# Altium schematic sheet Sheet1.SchDoc
size 420 x 297 mm; SheetNumber: 1; SheetTotal: 1
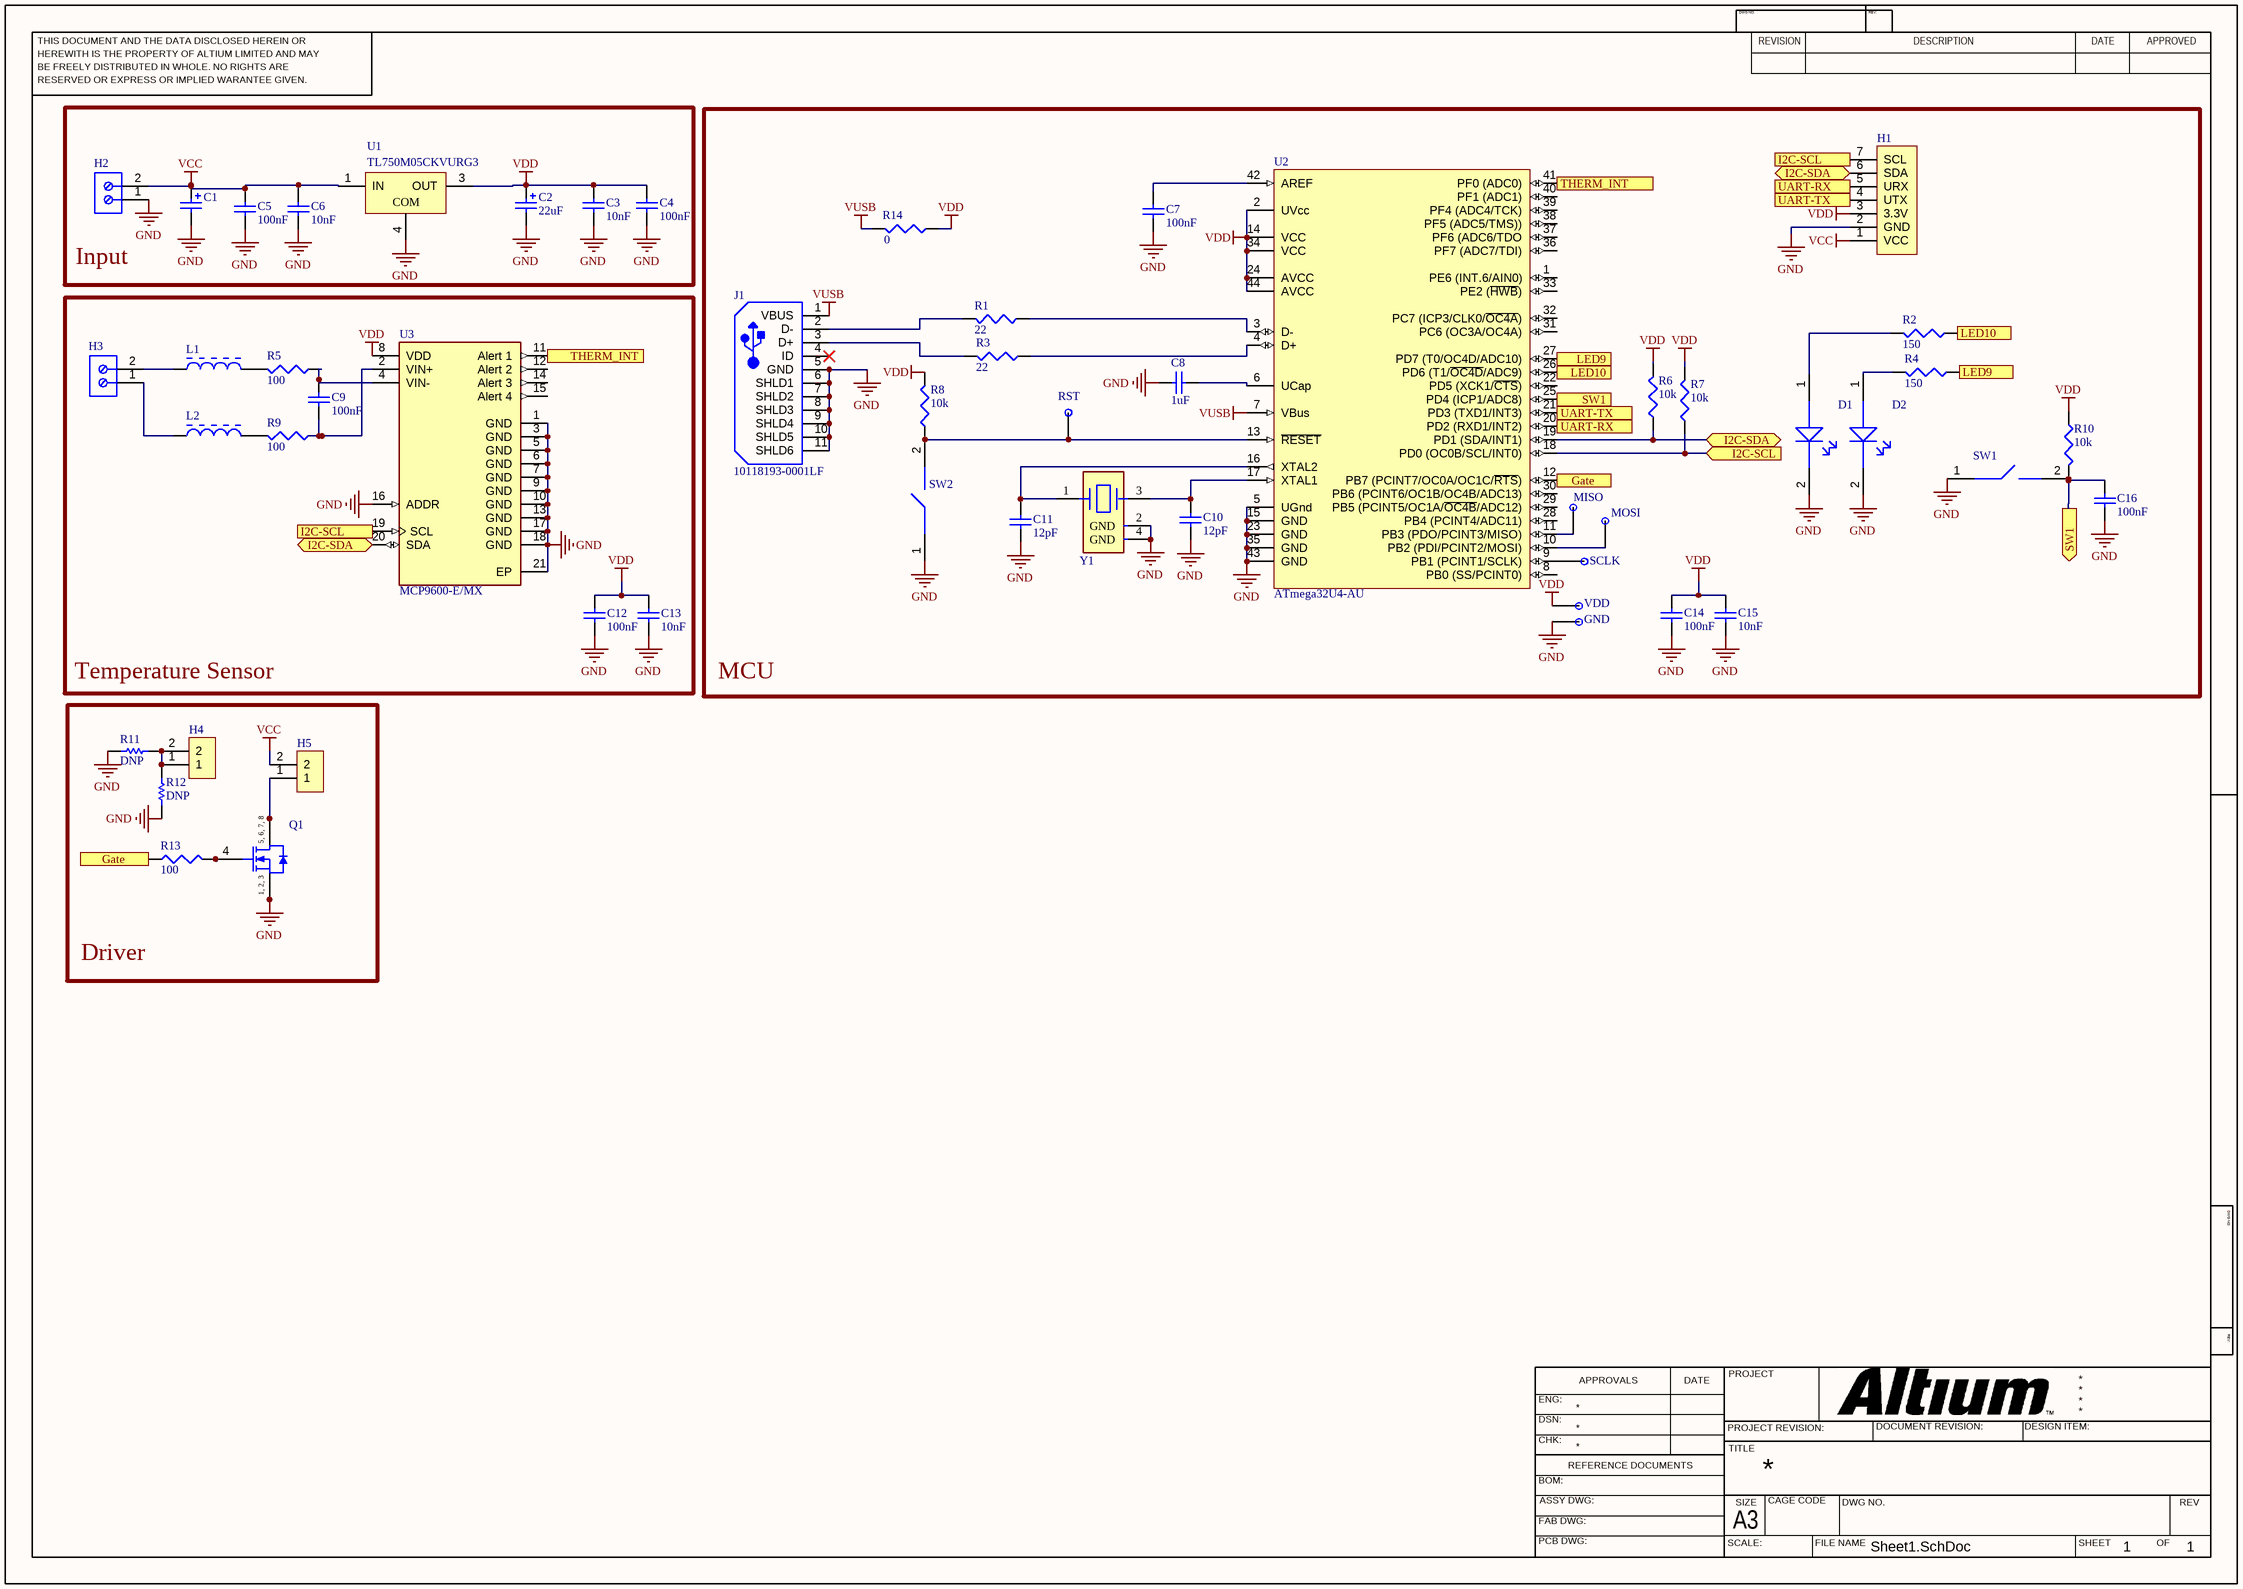
[diagram p0: Sheet1.SchDoc]

## Parts
C1  UBC1H470MNS1GS  [UBC1H470MNS1GS]  (value not drawn)
C2  22uF  [CAPAE4343X55M]
C3  10nF  [RESC1608X04N]
C4  100nF  [RESC1608X04N]
C5  100nF  [RESC1608X04N]
C6  10nF  [RESC1608X04N]
C7  100nF  [RESC1608X04N]
C8  1uF  [RESC1608X04N]
C9  100nF  [RESC1608X04N]
C10  12pF  [RESC1608X04N]
C11  12pF  [RESC1608X04N]
C12  100nF  [RESC1608X04N]
C13  10nF  [RESC1608X04N]
C14  100nF  [RESC1608X04N]
C15  10nF  [RESC1608X04N]
C16  100nF  [RESC1608X04N]
D1  'LTST-C190KFKT  [RESC1608X04N]  (value not drawn)
D2  'LTST-C190KFKT  [RESC1608X04N]  (value not drawn)
GND  TESTPAD  [TESTPAD]  (value not drawn)
H1  castellated holes  [castellated holes]  (value not drawn)
H2  691508110302  [691508110302]  (value not drawn)
H3  691508110302  [691508110302]  (value not drawn)
H4  MOTHER PADS  [MOTHER PADS]  (value not drawn)
H5  MOTHER PADS  [MOTHER PADS]  (value not drawn)
J1  10118193-0001LF  [FCI-10118193-0001LF-5_V]
L1  LI0805H151R-10  [LIRD-LI0805H151R-10-2_V]  (value not drawn)
L2  LI0805H151R-10  [LIRD-LI0805H151R-10-2_V]  (value not drawn)
MISO  TESTPAD  [TESTPAD]  (value not drawn)
MOSI  TESTPAD  [TESTPAD]  (value not drawn)
Q1  BSC0906NS  [INF-PG-TDSON-8-1_V]  (value not drawn)
R1  22  [RESC1608X04N]
R2  150  [RESC1608X04N]
R3  22  [RESC1608X04N]
R4  150  [RESC1608X04N]
R5  100  [RESC1608X04N]
R6  10k  [RESC1608X04N]
R7  10k  [RESC1608X04N]
R8  10k  [RESC1608X04N]
R9  100  [RESC1608X04N]
R10  10k  [RESC1608X04N]
R11  DNP  [RESC1005X40X25ML5T10]
R12  DNP  [RESC1005X40X25ML5T10]
R13  100  [RESC1608X04N]
R14  0  [RESC1608X04N]
RST  TESTPAD  [TESTPAD]  (value not drawn)
SCLK  TESTPAD  [TESTPAD]  (value not drawn)
SW1  PTS815 SJK 250 SMTR LFS  [PTS815 SJK 250 SMTR LFS]  (value not drawn)
SW2  PTS815 SJK 250 SMTR LFS  [PTS815 SJK 250 SMTR LFS]  (value not drawn)
U1  TL750M05CKVURG3  [KVU0003A_M]
U2  ATmega32U4-AU  [44ML_M]
U3  MCP9600-E/MX  [FP-C04-186-MFG]
VDD  TESTPAD  [TESTPAD]  (value not drawn)
Y1  TSX-3225 16.0000MF09Z-AC0  [FP-TSX-3225-MFG]  (value not drawn)

## Blocks framed on the sheet
Input: C1-C6 H2 U1
MCU: C7 C8 C10 C11 C14-C16 D1 D2 GND H1 J1 MISO MOSI R1-R4 R6-R8 R10 R14 RST SCLK SW1 SW2 U2 VDD Y1
Temperature Sensor: C9 C12 C13 H3 L1 L2 R5 R9 U3
Driver: H4 H5 Q1 R11-R13

## Ports
Gate (in), Gate (out), I2C-SCL (in), I2C-SDA (bidir), LED9 (in), LED9 (out), LED10 (in), LED10 (out), SW1 (in), SW1 (out), THERM_INT (out), UART-RX (in), UART-TX (in)

## Nets
GND: C1.2 C2.2 C3.1 C4.1 C5.1 C6.1 C7.2 C8.1 C10.2 C11.2 C12.2 C13.2 C14.2 C15.2 C16.2 D1.2 D2.2 GND.1 H1.2(GND) H2.1 J1.5(GND) J1.6(SHLD1) J1.7(SHLD2) J1.8(SHLD3) J1.9(SHLD4) J1.10(SHLD5) J1.11(SHLD6) Q1.1(SOURCE) Q1.2(SOURCE) Q1.3(SOURCE) R11.1 R12.1 SW1.1 SW2.1 U1.4(COM) U2.5(UGnd) U2.15(GND) U2.23(GND) U2.35(GND) U2.43(GND) U3.1(GND) U3.3(GND) U3.5(GND) U3.6(GND) U3.7(GND) U3.9(GND) U3.10(GND) U3.13(GND) U3.16(ADDR) U3.17(GND) U3.18(GND) U3.21(EP) Y1.2(GND) Y1.4(GND)
VCC: C1.1 C5.2 C6.2 H1.1(VCC) H2.2 H5.2 U1.1(IN)
VDD: C2.1 C3.2 C4.2 C12.1 C13.1 C14.1 C15.1 H1.3(3.3V) R6.2 R7.2 R8.2 R10.1 R14.1 U1.3(OUT) U2.2(UVcc) U2.14(VCC) U2.24(AVCC) U2.34(VCC) U2.44(AVCC) U3.8(VDD) VDD.1
VUSB: J1.1(VBUS) R14.2 U2.7(VBus)
Gate: R13.1 U2.12(PB7_(PCINT7/OC0A/OC1C/~{RTS})) ; port Gate
I2C-SCL: H1.7(SCL) R7.1 U2.18(PD0_(OC0B/SCL/INT0)) U3.19(SCL) ; port I2C-SCL
I2C-SDA: H1.6(SDA) R6.1 U2.19(PD1_(SDA/INT1)) U3.20(SDA) ; port I2C-SDA
LED9: R4.1 U2.27(PD7_(T0/OC4D/ADC10)) ; port LED9
LED10: R2.1 U2.26(PD6_(T1/~{OC4D}/ADC9)) ; port LED10
SW1: C16.1 R10.2 SW1.2 U2.25(PD4_(ICP1/ADC8)) ; port SW1
THERM_INT: U2.41(PF0_(ADC0)) U3.11(Alert_1) ; port THERM_INT
UART-RX: H1.5(URX) U2.20(PD2_(RXD1/INT2)) ; port UART-RX
UART-TX: H1.4(UTX) U2.21(PD3_(TXD1/INT3)) ; port UART-TX
NetC7_1: C7.1 U2.42(AREF)
NetC8_2: C8.2 U2.6(UCap)
NetC9_1: C9.1 R5.1 U3.4(VIN-)
NetC9_2: C9.2 R9.1 U3.2(VIN+)
NetC10_1: C10.1 U2.17(XTAL1) Y1.3
NetC11_1: C11.1 U2.16(XTAL2) Y1.1
NetD1_1: D1.1 R2.2
NetD2_1: D2.1 R4.2
NetH3_1: H3.1 L2.1
NetH3_2: H3.2 L1.1
NetH4_1: H4.1 H4.2 R11.2 R12.2
NetH5_1: H5.1 Q1.5(DRAIN) Q1.6(DRAIN) Q1.7(DRAIN) Q1.8(DRAIN)
NetJ1_2: J1.2(D-) R1.2
NetJ1_3: J1.3(D+) R3.2
NetL1_2: L1.2 R5.2
NetL2_2: L2.2 R9.2
NetMISO_1: MISO.1 U2.11(PB3_(PDO/PCINT3/MISO))
NetMOSI_1: MOSI.1 U2.10(PB2_(PDI/PCINT2/MOSI))
NetQ1_4: Q1.4(GATE) R13.2
NetR1_1: R1.1 U2.3(D-)
NetR3_1: R3.1 U2.4(D+)
NetR8_1: R8.1 RST.1 SW2.2 U2.13(~{RESET})
NetSCLK_1: SCLK.1 U2.9(PB1_(PCINT1/SCLK))

Not connected (* = marked no-connect by the designer): J1 4(ID)*; U2 1(PE6_(INT.6/AIN0)) 8(PB0_(SS/PCINT0)) 22(PD5_(XCK1/~{CTS})) 28(PB4_(PCINT4/ADC11)) 29(PB5_(PCINT5/OC1A/~{OC4B}/ADC12)) 30(PB6_(PCINT6/OC1B/OC4B/ADC13)) 31(PC6_(OC3A/OC4A)) 32(PC7_(ICP3/CLK0/~{OC4A})) 33(PE2_(~{HWB})) 36(PF7_(ADC7/TDI)) 37(PF6_(ADC6/TDO) 38(PF5_(ADC5/TMS))) 39(PF4_(ADC4/TCK)) 40(PF1_(ADC1)); U3 12(Alert_2) 14(Alert_3) 15(Alert_4)

## Notes on the sheet
- THIS DOCUMENT AND THE DATA DISCLOSED HEREIN OR
- HEREWITH IS THE PROPERTY OF ALTIUM LIMITED AND MAY
- DWG NO:
- REVISION
- REV:
- DESCRIPTION
- DATE
- APPROVED
- BE FREELY DISTRIBUTED IN WHOLE. NO RIGHTS ARE
- RESERVED OR EXPRESS OR IMPLIED WARANTEE GIVEN.
- ENG:
- APPROVALS
- PROJECT
- DSN:
- CHK:
- REFERENCE DOCUMENTS
- PROJECT REVISION:
- TITLE
- DOCUMENT REVISION:
- DESIGN ITEM:
- BOM:
- FAB DWG:
- PCB DWG:
- ASSY DWG:
- SCALE:
- A3
- SIZE
- CAGE CODE
- FILE NAME
- DWG NO.
- SHEET
- OF
- REV
- (in symbol CMP-1090-00064-1) 5, 6, 7, 8; 1, 2, 3

## Library data of the parts
C2 = CAP*
C3-C16 = CAP
D1 D2 = LED
H2 H3 = CMP-1502-02490-1: Serie 5081 - 3.50 mm Horizontal Entry SMT with Rising Cage Clamp WR-TBL, 2 pin; Manufacturer: Wurth Elektronik; Pitch: 3.50mm; Pin Number: 2; Mounting Technology: SMT; Packaging: TapeandReelwithCap; Part Number: 691508110302; Datasheet URL: http://katalog.we-online.de/em/datasheet/6915081103xx.pdf; Manufacturer URL: http://www.we-online.de; Publisher: WurthElektronik; Package Reference: 691508110302; Operating Temperature: -40to130degC
J1 = CMP-2000-05119-1: Micro USB B Type Receptacle, -55 to 85 degC, 5-Pin SMD, RoHS, Tape and Reel; Manufacturer: FCI; Insulation Resistance: 1000MOhms; Gender: Female; Current Rating: 1.8A; Number of Contacts: 5Contact; Connector Type: MicroUSBTypeBreceptacle; Mounting Angle: Right; Datasheet Version: Rev. C, 05/2015; Packaging: Reel; Product Category: USBConnectors; Standard: USB2.0; Factory Pack Quantity: 1200; Operating Temperature Range: -55Cto+85C; Termination Style: SMD/SMT; Datasheet URL: http://datasheet.octopart.com/10118193-0001LF-FCI-datasheet-55953155.pdf; Contact Material: CopperAlloy; RoHS: Details; Contact Plating: Gold; Flammability Rating: UL94V-0; Manufacturer URL: http://www.fci.com/; Brand: FCI; Product: MicroUSBTypeBConnectors; Color: Black
L1 L2 = CMP-2000-05195-1: Chip Beads for Signal Filtering, 0.15 Ohms, -40 to 125 degC, 2-Pin SMD, RoHS, Tape and Reel; Manufacturer: Laird; Current Rating (Max): 800mA; DC Resistance (DCR) (Max): 150mOhm; Impedance @ Frequency: 150Ohm@100MHz; Online Catalog: LISeries; Kits: 240-2227-ND-KITEMIFERRITEBEADCHIPSMD; Catalog Drawings: (HI,HZ,LI,MI)0805Series_1.10mmMax.Height; Filter Type: SignalLine; Number of Lines: 1; Other Names: 240-2384-1; Package Version: Rev. D, 08/2013; Series: LI; Height (Max): 0.043"(1.10mm); Datasheet Version: Rev. D, 08/2013; Category: Filters; Package Reference: LI0805H15R-10-2; Ratings: -; Family: FerriteBeadsandChips; Standard Package: 1; Package URL: http://cdn.lairdtech.com/home/brandworld/files/LI0805H151R-10.pdf; Operating Temperature: -40degC~125degC; Package Description: 2-Pin Surface Mount Device, Body 2 x 1.25 mm; Packaging: CutTape(CT); Manufacturer URL: https://www.lairdtech.com; Package / Case: 0805(2012Metric); Size / Dimension: 0.079"Lx0.049"W(2.00mmx1.25mm); Datasheet URL: http://cdn.lairdtech.com/home/brandworld/files/LI0805H151R-10.pdf; Mounting Type: SurfaceMount
Q1 = CMP-1090-00064-1: N-Channel OptiMOS Power-MOSFET, 30 V VDS, 63 A ID, -55 to 150 degC, PG-TDSON-8-1, Reel, Green; Manufacturer: Infineon; RthJC (max): 4.2Â K/W; RDS (on) (max): 4.5Â mOhm; IDpuls (max): 252Â A; QG: 6.7Â nC; Green: TRUE; VGS(th) (max): 2Â V; RthJA (max): 50Â K/W; Polarity: N; RDS (on) (max) (@4.5V): 6.4Â mOhm; ID (max): 63Â A; VDS (max): 30Â V; Ptot (max): 30Â W; VGS(th) (min): 1.2Â V; ComponentLink1Description: Manufacturer URL; Rth: 4.2Â K/W; ComponentLink3Description: Package Specification; ComponentLink2URL: http://www.infineon.com/dgdl/BSC0906NS_Rev+2.pdf?folderId=db3a304313b8b5a60113cee8763b02d7&fileId=db3a30433072cd8f0130986c816b2f8c; ComponentLink3URL: http://www.infineon.com/cms/packages/SMD_-_Surface_Mounted_Devices/P-PG-TDSON/P-PG-TDSON-08-01x_2x_3.html?__locale=en; DatasheetVersion: Rev. 2.0; PackageReference: PG-TDSON-8-1; Halogen-free: TRUE; PackageDescription: 8-Pin Plastic (Green) Thin Dual Small Outline Non-Leaded Package, 5.15 x 5.9 mm Body, 1.27 mm Pitch; Packing: Reel; PartNumber: BSC0906NS; Mounting Technology: Surface Mount; ComponentLink1URL: http://www.infineon.com/; ComponentLink2Description: Datasheet
R1-R10 R13 R14 = RES
R11 R12 = CMP-2002-07915-2: 'RC0402JR-0710KL; Resistance: 10 kohm; Voltage Rating (DC): 50 V; Power Rating: 63 mW; Tolerance: 5%; Case\Package: 0402; RoHSCompliant: true; DatasheetVersion: Rev. 4, 02/2016; ComponentLink1Description: Manufacturer URL; PackageDescription: 2-Pin Surface Mount Device, Body 1 x 0.5 mm; Case Code (Imperial): 0402; PackageReference: 0402; ComponentLink1URL: http://www.yageo.com/; Mounting Technology: Surface Mount; REACH SVHC: No SVHC; ComponentLink2Description: Datasheet; Case Code (Metric): 1005; Width: 0.5 mm; Package Quantity: 10000; Packaging: Tape and Reel; Max Operating Temperature: 155 degC; Mount: Surface Mount; Length: 1 mm; ComponentLink2URL: http://www.yageo.com/documents/recent/PYu-RC_Group_51_RoHS_L_04.pdf; Height: 0.35 mm; Voltage Rating: 50 V; Pins: 2; Min Operating Temperature: -55 degC
U1 = CMP-0395-01077-2: Single Output LDO, 750 mA, Fixed 5 V Output, 6 to 26 V Input, with Low IQ, 3-pin PFM (KVU), 0 to 125 degC, Green (RoHS & no Sb/Br); Manufacturer: Texas Instruments; Accuracy(%): 2; SubFamily: Single Channel LDO; Vin(Min)(V): 6; Vout Adj(Max)(V): 5; Vdo(Typ)(mV): 600; Iout(Max)(A): 0.75; Vin(Max)(V): 26; Rating: Catalog; Iq(Typ)(mA): 60; PackageVersion: 4205521-2/D; ComponentLink3Description: Package Specification; ComponentLink4URL: Samples URL:http://www.ti.com/product/tl750m05#samples; ComponentLink1URL: http://www.ti.com/; PackageReference: KVU0003A; Eco-Plan: Green (RoHS & no Sb/Br); DatasheetVersion: SLVS021N; ComponentLink1Description: Manufacturer URL; Vout Adj(Min)(V): 5; PartNumber: TL750M05CKVURG3; Mounting Technology: Surface Mount; ComponentLink2URL: http://www.ti.com/general/docs/lit/getliterature.tsp?genericPartNumber=TL750M05&fileType=pdf; ComponentLink2Description: Datasheet; ComponentLink3URL: http://www.ti.com/litv/pdf/mpsf018c; Code_JEDEC: TO-252; PackageDescription: 3-Pin Plastic Flange Mount, Body 6.1 x 6.6 mm, Pitch 2.29 mm; Fixed Output Options(V): 5; ComponentLink4Description: URL Link1
U2 = CMP-0095-00285-2: 8-bit AVR Microcontroller, 2.7-5.5V, 16MHz, 32KB Flash, 1KB EEPROM, 2.5KB SRAM, USB Controller, 44-pin TQFP, Industrial Grade (-40°C to 85°C), Ext Osc; RevisionNote: DatasheetVersion updated. URLs added.; ComponentLink1Description: Manufacturer URL; PackageDescription: 44-Pin Plastic Thin Quad Flat Pack, 10 x 10 x 1.0 mm Body, 0.8 mm Pitch (TQFP); DatasheetVersion: revF, Nov-2010; ComponentLink2URL: http://www.atmel.com/dyn/resources/prod_documents/doc7766.pdf; ComponentLink1URL: http://www.atmel.com/; PackageReference: 44ML; ComponentLink2Description: ATmega16U4/32U4 Datasheet; PackageVersion: rev.G, Jul-2007; ComponentLink3URL: http://www.atmel.com/dyn/resources/prod_documents/7766S.pdf; ComponentLink3Description: ATmega16U4 ATmega32U4 Summary
U3 = CMP-06290-000001-1: IC THERMOCOUPLE TO I2C 20MQFN; Manufacturer: Microchip; Min Supply Voltage: 2.7V; Standoff Height: 0mm; Nominal Supply Current: 0.3-1.5mA; Max Supply Voltage: 5.5V; Interface: I2C,2-Wire; Max Junction Temp: +150°C; Sensor Input: Thermocouple; ComponentLink2URL: http://ww1.microchip.com/downloads/en/DeviceDoc/MCP960X-L0X-RL0X-Data-Sheet-20005426F.pdf; Octopart: https://octopart.com/mcp9600-e%2Fmx-microchip-71651858; Temperature: -40°C to +125°C; Device Class L2: Interface ICs; Height: 1mm; Manufacturer Part Number: MCP9600-E/MX; Digikey Description: IC THERMOCOUPLE TO I2C 20MQFN; Ipc Land Pattern Name: QFN65P500X500X95-20; ComponentLink2Description: Datasheet; Device Class L1: Integrated Circuits (ICs); Device Class L3: Sensor and Detector Interfaces; Ambient Temperature Range Low: -40°C; Ambient Temperature Range High: +125°C; Automotive: No; Sensor Output: I2C; Package: C04-186; Temperature Range High: +125°C; RoHS: TRUE; Category: IC; Temperature Range Low: -40°C; Lead Free: Yes
Y1 = CMP-36405-000014-1: CRYSTAL 16.0000MHZ 9PF SMD; Tolerance: 10ppm; Frequency: 16MHz; Drive Level: 200uW; Frequency Stability: 9ppm; ESR (Equivalent Series Resistance): 60R; Min Operating Temperature: -20°C; Packaging: Tape and Reel; Lead Free: Lead Free; Mount: Surface Mount; Width: 0.098inch; Length: 0.126inch; Weight: 0.000564oz; Max Operating Temperature: 75°C; Frequency Tolerance: 10ppm; Case/Package: SMD/SMT; Height: 0.024inch; Termination: SMD/SMT; Package Quantity: 1000; Load Capacitance: 9pF; RoHS Compliant: Yes; Series: TSX-3225